# EAGLE design P.V.S.AVINASH  AS-1 (EAGLE 9.6.2)
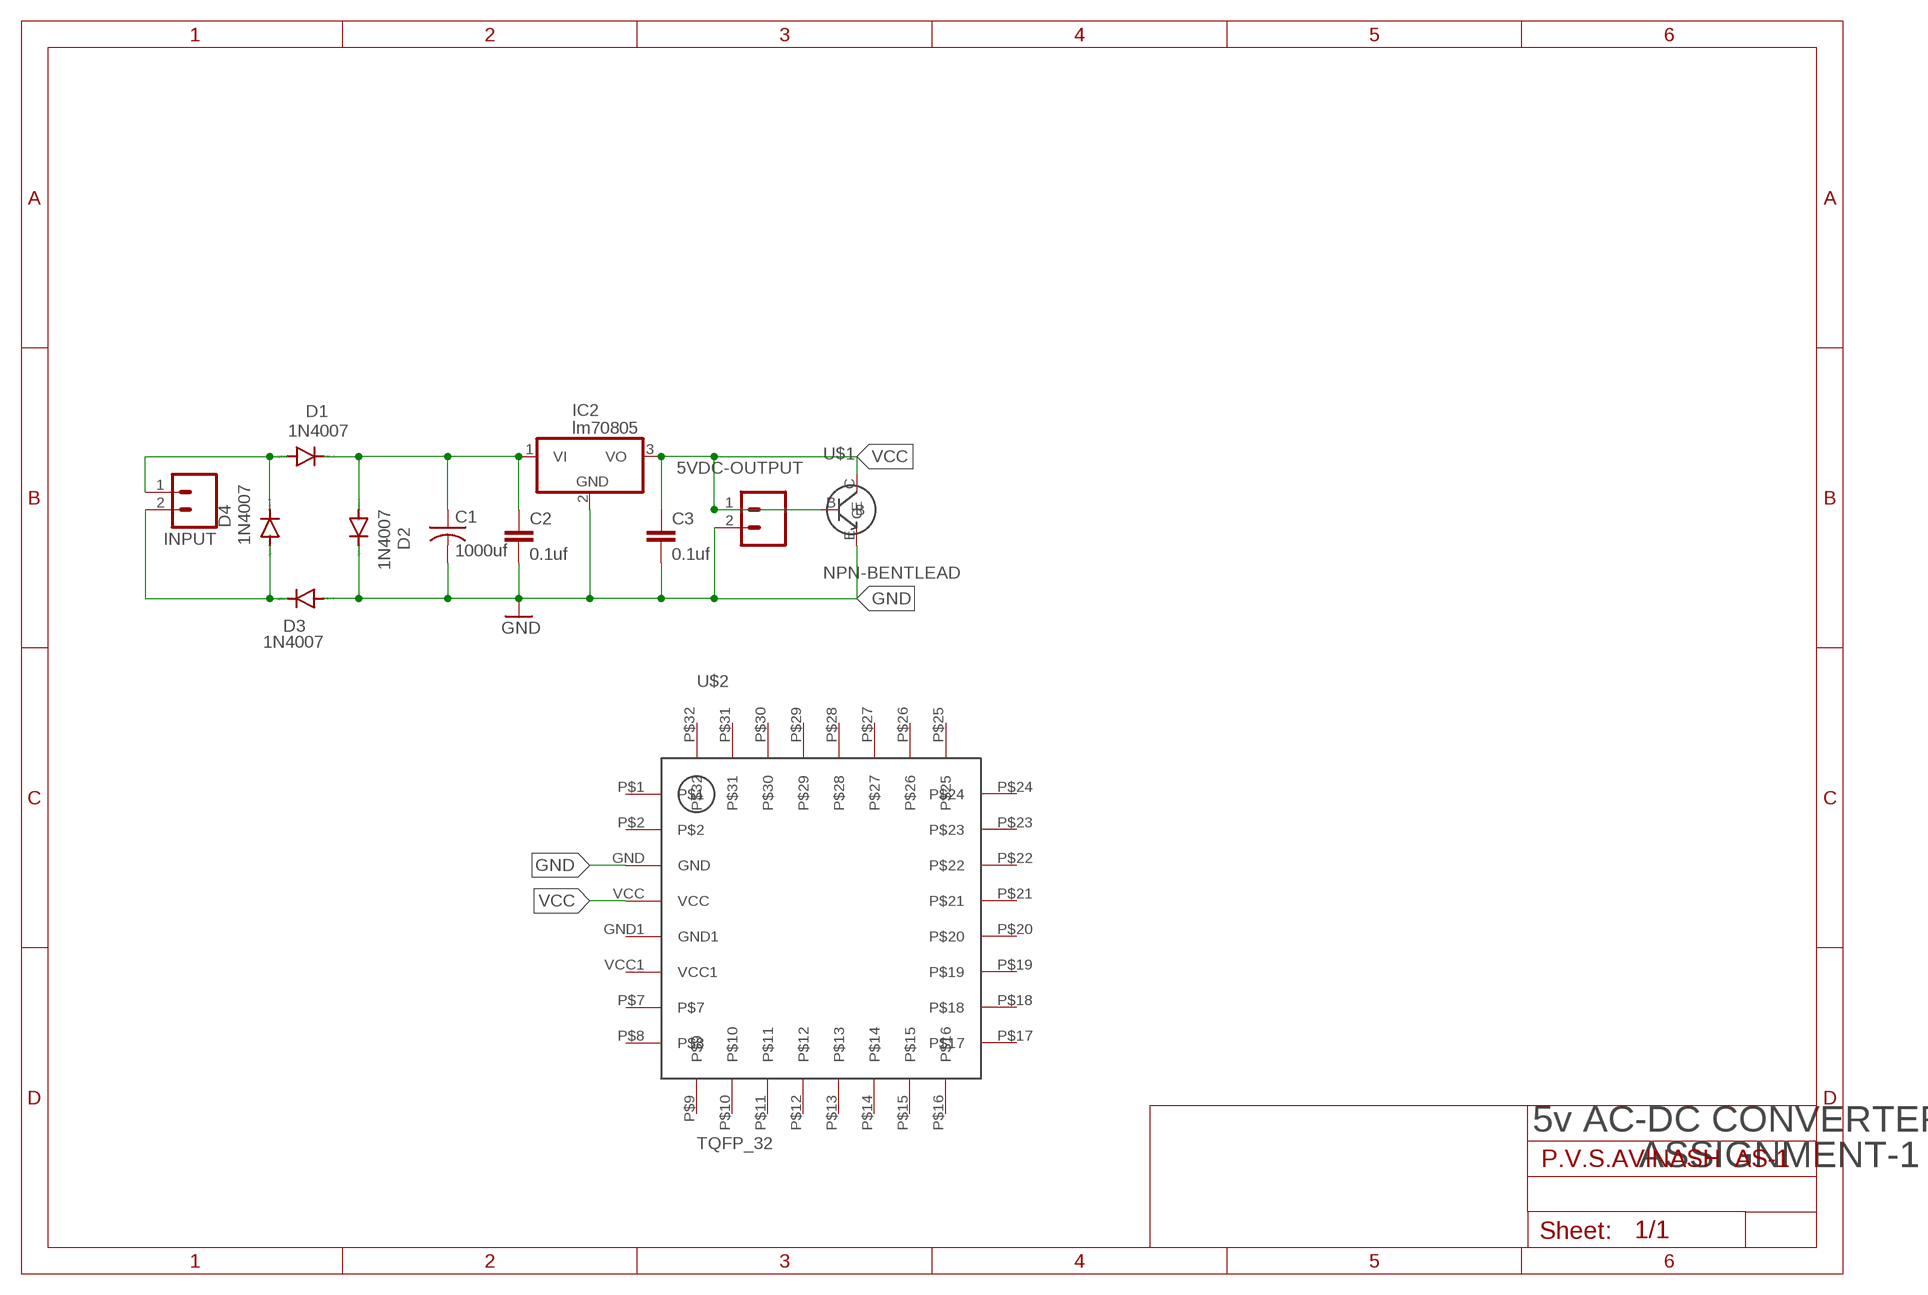
[diagram p0: schematic, sheet 1]

## Parts
5VDC-OUTPUT  M02  [02P]
C1  1000uf  C-US025-024X044  [C025-024X044]
C2  0.1uf  C-EU025-025X050  [C025-025X050]
C3  0.1uf  C-EU025-025X050  [C025-025X050]
D1  1N4007  1N4004  [DO41-10]
D2  1N4007  1N4004  [DO41-10]
D3  1N4007  1N4004  [DO41-10]
D4  1N4007  1N4004  [DO41-10]
IC2  lm70805  786TV  [TO220V]
INPUT  M02  [02P]
U$1  NPN-BENTLEAD  [BENT-LEAD]
U$2  TQFP_32  [TQFP_32]

## Nets
GND: 5VDC-OUTPUT.2 C1.2 C2.2 C3.2 D2.C D3.A IC2.2(GND) U$1.E U$2.GND
N$1: D1.A D4.C INPUT.1
N$2: D3.C D4.A INPUT.2
N$3: C1.1 C2.1 D1.C D2.A IC2.1(VI)
VCC: 5VDC-OUTPUT.1 C3.1 IC2.3(VO) U$1.B U$1.C U$2.VCC
Unconnected: U$2.GND1 U$2.P$1 U$2.P$2 U$2.P$7 U$2.P$8 U$2.P$9 U$2.P$10 U$2.P$11 U$2.P$12 U$2.P$13 U$2.P$14 U$2.P$15 U$2.P$16 U$2.P$17 U$2.P$18 U$2.P$19 U$2.P$20 U$2.P$21 U$2.P$22 U$2.P$23 U$2.P$24 U$2.P$25 U$2.P$26 U$2.P$27 U$2.P$28 U$2.P$29 U$2.P$30 U$2.P$31 U$2.P$32 U$2.VCC1

## Notes on the sheet
- 5v AC-DC CONVERTER
- ASSIGNMENT-1

## Library data of the parts
5VDC-OUTPUT INPUT = con-amp-quick:M02: AMP QUICK CONNECTOR; OC_FARNELL: unknown; OC_NEWARK: unknown
C1 = rcl:C-US: CAPACITOR, American symbol; SPICEPREFIX: C
C2 C3 = rcl:C-EU: CAPACITOR, European symbol; SPICEPREFIX: C
D1-D4 = diode:1N4004: DIODE general purpose rectifier, 1 A
IC2 = linear:78*: Positive VOLTAGE REGULATOR Source: http://cache.national.com/ds/LM/LM78L05.pdf http://www.fairchildsemi.com/ds/LM/LM7805.pdf
U$1 = BC368:NPN-BENTLEAD
U$2 = SAM-MEGA8:TQFP_32

## Board
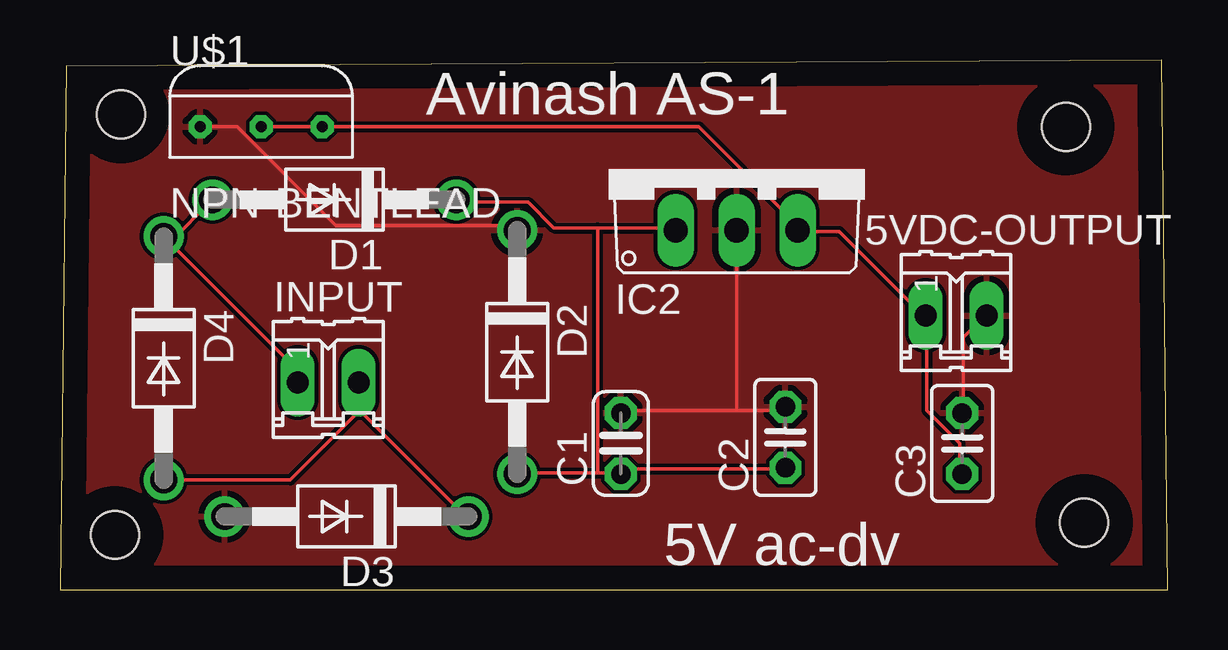
[diagram p1: board, top side]
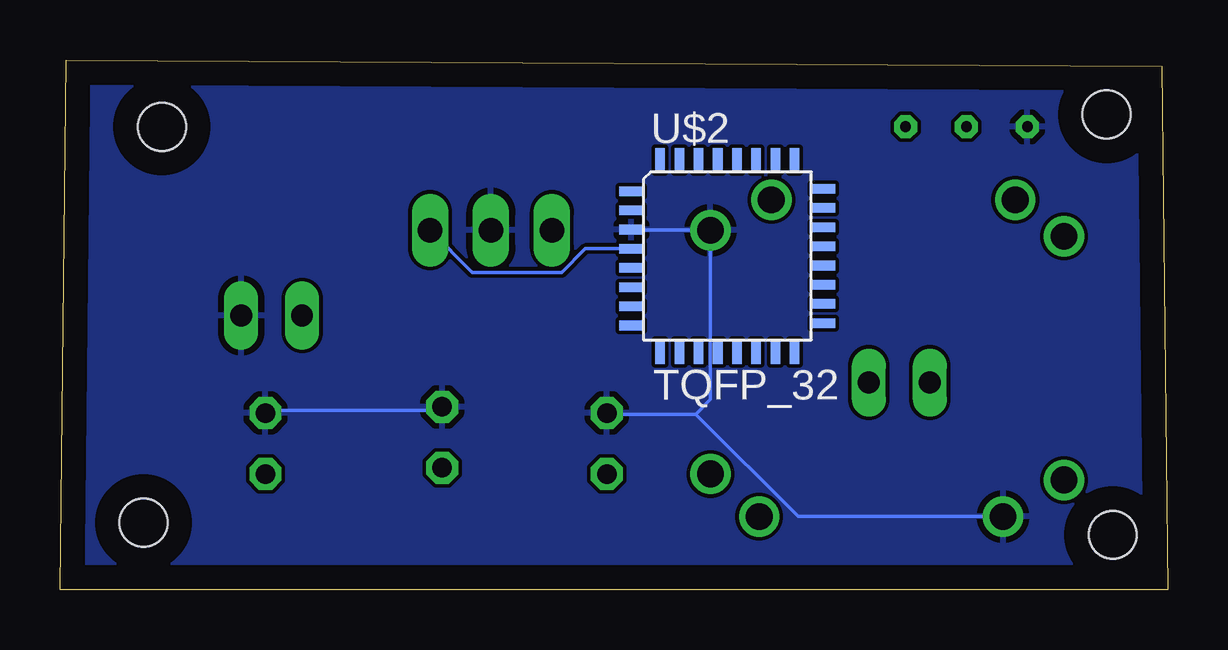
[diagram p2: board, bottom side, seen from below]

Size 46.15 x 22.09 mm. Coordinates in mm from the lower left corner, seen from the top.
Outline: 0,0 46.15,0 45.9,22.09 0.25,21.83 0,0
Copper layers (1*16): Top 0.035mm / dielectric 1.5mm / Bottom 0.035mm
Design rules "default": minimum track width 6mil, minimum drill 0.35mm, track to track 6mil, track to pad 6mil, pad to pad 6mil, via to via 6mil, smd to smd 6mil, copper to edge 40mil, drill to drill 6mil, minimum pad ring 10mil, minimum via ring 8mil, stop-mask expansion 4mil, vias tented up to drill 0mil, thermal gap 10mil
Holes 2 mm at 2.54,19.81 2.29,2.29 41.91,19.3 42.67,2.79

### Footprints (pad centres in the part's own frame; a part is rotated, then mirrored left to right if it is on the bottom)
02P = drill 0.914 long: 1 -1.27,0; 2 1.27,0
C025-024X044 = drill 0.813 octagon: 1 -1.27,0; 2 1.27,0
C025-025X050 = drill 0.813 octagon: 1 -1.27,0; 2 1.27,0
DO41-10 = drill 1.118: A 5.08,0; C -5.08,0
TO220V = drill 1.016 long: 1 -2.54,-2.54; 2 0,-2.54; 3 2.54,-2.54
BENT-LEAD = drill 0.45 octagon: B -10.16,6.35; C -12.7,6.35; E -15.24,6.35
TQFP_32 = smd 1 x 0.4: GND -0.5,4.6; GND1 -0.5,3; P$1 -0.5,6.2; P$2 -0.5,5.4; P$7 -0.5,1.4; P$8 -0.5,0.6; P$17 7.5,0.7; P$18 7.5,1.5; P$19 7.5,2.3; P$20 7.5,3.1; P$21 7.5,3.9; P$22 7.5,4.7; P$23 7.5,5.5; P$24 7.5,6.3; VCC -0.5,3.8; VCC1 -0.5,2.2 | smd 0.4 x 1: P$9 0.7,-0.5; P$10 1.5,-0.5; P$11 2.3,-0.5; P$12 3.1,-0.5; P$13 3.9,-0.5; P$14 4.7,-0.5; P$15 5.5,-0.5; P$16 6.3,-0.5; P$25 6.3,7.5; P$26 5.5,7.5; P$27 4.7,7.5; P$28 3.9,7.5; P$29 3.1,7.5; P$30 2.3,7.5; P$31 1.5,7.5; P$32 0.7,7.5

### Placement (x,y rotation side)
5VDC-OUTPUT  37.34,11.43 0 top
C1  23.37,6.1 90 top
C2  30.23,6.35 90 top
C3  37.59,6.1 90 top
D1  11.43,16.26 180 top
D2  19.05,9.91 270 top
D3  11.94,3.05 180 top
D4  4.32,9.65 270 top
IC2  28.19,17.53 0 top
INPUT  11.18,8.64 0 top
U$1  21.08,12.95 0 top
U$2  21.84,10.41 0 bottom

### Tracks (layer width: path | path; a pad name or v marks a point on that pad's centre or on a via)
GND
  Top 0.152: C3.2 37.64,7.47 37.64,10.52 38.56,11.43 5VDC-OUTPUT.2 | 28.19,7.47 30.02,7.47 30.18,7.62 C2.2 | 28.19,7.47 23.47,7.47 C1.2 | 28.19,7.47 IC2.2 | U$1.E 7.38,19.3 11.5,15.19 18.85,15.19 D2.C
  Bottom 0.152: D3.A 15.39,3.05 19.66,7.32 | 19.66,7.32 23.32,7.32 C1.2 | 19.66,7.32 19.05,7.92 D2.C 22.32,14.99 U$2.GND | C3.2 37.49,7.47 30.48,7.47 30.33,7.62 C2.2
  pour Top: -0.51,22.35 46.48,22.35 46.48,-0.25 46.74,-0.51 -0.51,-0.51
  pour Bottom: -1.02,22.86 46.74,22.86 46.99,22.61 46.99,-1.02 -1.02,-1.02
N$1
  Top 0.152: INPUT.1 9.91,9.14 4.57,14.48 | 4.57,14.48 D4.C 4.42,14.63 | 4.57,14.48 D1.A
N$2
  Top 0.152: 12.5,7.47 12.5,8.53 INPUT.2 12.5,7.47 | 12.5,7.47 16.92,3.05 D3.C | D4.A 9.6,4.57 12.5,7.47
N$3
  Top 0.152: 22.4,15.09 20.57,15.09 19.51,16.15 16.61,16.15 D1.C | 22.4,15.09 25.6,15.09 IC2.1 | 22.4,4.88 19.05,4.88 D2.A | 22.4,4.88 23.32,4.88 C1.1 23.47,4.88 23.62,5.03 30.18,5.03 C2.1 | 22.4,4.88 22.4,15.09
VCC
  Top 0.152: C3.1 37.49,4.88 37.49,6.1 36.12,7.47 36.12,11.43 5VDC-OUTPUT.1 35.97,11.43 32.46,14.94 30.99,14.94 | 30.99,14.94 30.79,14.94 IC2.3 | U$1.C U$1.B 26.62,19.3 30.99,14.94
  Bottom 0.152: U$2.VCC 24.26,14.21 25.24,13.23 28.98,13.23 IC2.3

### Text on the board
tPlace: Avinash AS-1 | 5V ac-dv